# EAGLE design metium_rfm69 (EAGLE 7.6.0)
CNAME: An AA size RF Arduino clone; CREVISION: 1; DESIGNER: Dariusz Mazur
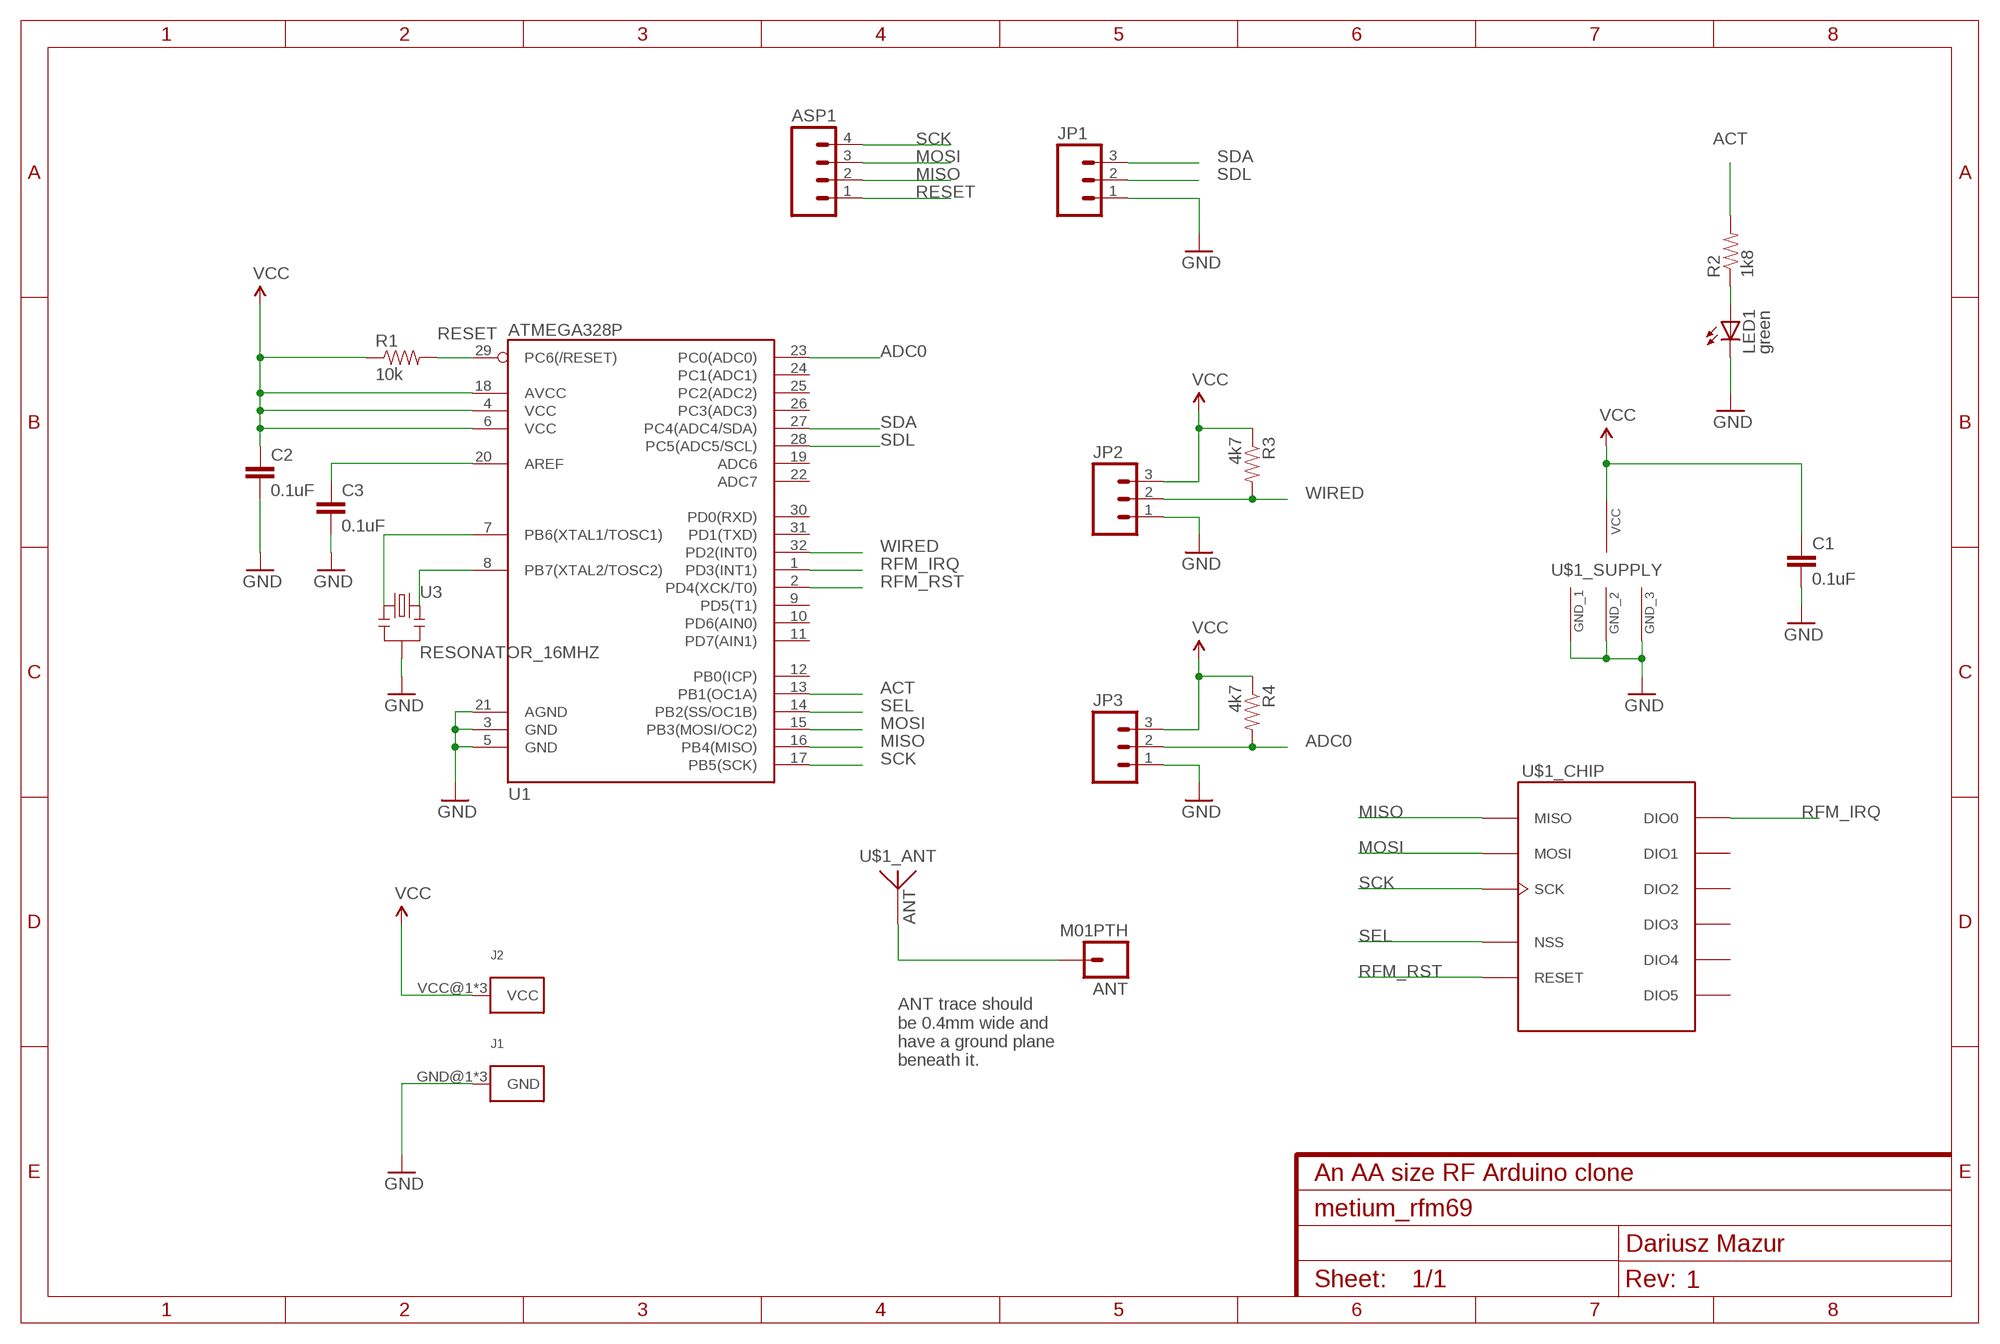
[diagram p0: schematic, sheet 1]

## Parts
ANT  M01PTH  [1X01]
ASP1  M04PTH  [1X04]
C1  0.1uF  0.1UF-25V(+80/-20%)(0603)  [0603-CAP]
C2  0.1uF  0.1UF-25V(+80/-20%)(0603)  [0603-CAP]
C3  0.1uF  0.1UF-25V(+80/-20%)(0603)  [0603-CAP]
J1  KEYSTONE-629  [KEYSTONE_AA_AAA_BATTERY_TERMINAL-629]
J2  KEYSTONE-637  [KEYSTONE_AA_AAA_BATTERY_TERMINAL-637]
JP1  M03PTH  [1X03]
JP2  M03PTH  [1X03]
JP3  M03PTH  [1X03]
LED1  green  LED0603  [LED-0603]
R1  10k  RESISTOR0603-RES  [0603-RES]
R2  1k8  RESISTOR0603-RES  [0603-RES]
R3  4k7  RESISTOR0603-RES  [0603-RES]
R4  4k7  RESISTOR0603-RES  [0603-RES]
U1  ATMEGA328P  ATMEGA328_SMT  [TQFP32-08]
U3  RESONATOR_16MHZ  [RESONATOR_SMD]
U$1  RFM69HCW-S2  [HOPE-RF-16]

## Nets
ACT: R2.2 U1.13(PB1(OC1A))
ADC0: JP3.2 R4.2 U1.23(PC0(ADC0))
GND: C1.2 C2.2 C3.2 J1.GND@1(GND) J1.GND@2(GND) J1.GND@3(GND) JP1.1 JP2.1 JP3.1 LED1.C U1.3(GND) U1.5(GND) U1.21(AGND) U3.2 U$1.GND1(_SUPPLY:GND_1) U$1.GND2(_SUPPLY:GND_2) U$1.GND3(_SUPPLY:GND_3)
MISO: ASP1.2 U1.16(PB4(MISO)) U$1.MISO(_CHIP:MISO)
MOSI: ASP1.3 U1.15(PB3(MOSI/OC2)) U$1.MOSI(_CHIP:MOSI)
N$1: LED1.A R2.1
N$3: ANT.1 U$1.ANT(_ANT:ANT)
N$4: C3.1 U1.20(AREF)
N$5: U1.7(PB6(XTAL1/TOSC1)) U3.1
N$6: U1.8(PB7(XTAL2/TOSC2)) U3.3
RESET: ASP1.1 R1.2 U1.29(PC6(/RESET))
RFM_IRQ: U1.1(PD3(INT1)) U$1.DIO0(_CHIP:DIO0)
RFM_RST: U1.2(PD4(XCK/T0)) U$1.RESET(_CHIP:RESET)
SCK: ASP1.4 U1.17(PB5(SCK)) U$1.SCK(_CHIP:SCK)
SDA: JP1.3 U1.27(PC4(ADC4/SDA))
SDL: JP1.2 U1.28(PC5(ADC5/SCL))
SEL: U1.14(PB2(SS/OC1B)) U$1.NSS(_CHIP:NSS)
VCC: C1.1 C2.1 J2.VCC@1(VCC) J2.VCC@2(VCC) J2.VCC@3(VCC) JP2.3 JP3.3 R1.1 R3.1 R4.1 U1.4(VCC) U1.6(VCC) U1.18(AVCC) U$1.3.3V(_SUPPLY:VCC)
WIRED: JP2.2 R3.2 U1.32(PD2(INT0))
Unconnected: U1.9(PD5(T1)) U1.10(PD6(AIN0)) U1.11(PD7(AIN1)) U1.12(PB0(ICP)) U1.19(ADC6) U1.22(ADC7) U1.24(PC1(ADC1)) U1.25(PC2(ADC2)) U1.26(PC3(ADC3)) U1.30(PD0(RXD)) U1.31(PD1(TXD)) U$1.DIO1(_CHIP:DIO1) U$1.DIO2(_CHIP:DIO2) U$1.DIO3(_CHIP:DIO3) U$1.DIO4(_CHIP:DIO4) U$1.DIO5(_CHIP:DIO5)

## Notes on the sheet
- ANT trace should
  be 0.4mm wide and
  have a ground plane
  beneath it.

## Library data of the parts
ANT = SparkFun-Connectors:M01: Header 1 Standard 1-pin 0.1" header. Use with straight break away headers (SKU : PRT-00116), right angle break away headers (PRT-00553), swiss pins (PRT-00743), machine pins (PRT-00117), and female headers (PRT-00115).
ASP1 = SparkFun-Connectors:M04: Header 4 Standard 4-pin 0.1" header. Use with straight break away headers (SKU : PRT-00116), right angle break away headers (PRT-00553), swiss pins (PRT-00743), machine pins (PRT-00117), and female headers (PRT-00115). Molex polarized connector foot print use with SKU : PRT-08231 with associated crimp pins and housings. 1MM SMD Version SKU: PRT-10208; PROD_ID: CONN-09696
C1-C3 = SparkFun-Capacitors:0.1UF-25V(+80/-20%)(0603): CAP-00810 Ceramic Standard decoupling cap; PROD_ID: CAP-00810
J1 = kanflo:KEYSTONE-629: Keystone 629 PCB Mount Battery Contact for 1 (AA), 1 (AAA), 1 (N), Coil Spring Contact Links Data sheet <http://docs-europe.electrocomponents.com/webdocs/002e/0900766b8002ef6f.pdf> RS Online <http://se.rs-online.com/web/p/battery-holders-mounts/2050057/>
J2 = kanflo:KEYSTONE-637: Keystone 637 PCB Mount Battery Contact for 1 (AA), 1 (AAA), 1 (N), Button Contact Links Data sheet <http://docs-europe.electrocomponents.com/webdocs/13ee/0900766b813ee63e.pdf> RS Online <http://se.rs-online.com/web/p/battery-holders-mounts/3670602/>
JP1-JP3 = SparkFun-Connectors:M03: Header 3 Standard 3-pin 0.1" header. Use with straight break away headers (SKU : PRT-00116), right angle break away headers (PRT-00553), swiss pins (PRT-00743), machine pins (PRT-00117), and female headers (PRT-00115). Molex polarized connector foot print use with SKU : PRT-08232 with associated crimp pins and housings.
LED1 = SparkFun-LED:LED: LEDs Standard schematic elements and footprints for 5mm, 3mm, 1206, and 0603 sized LEDs. 5mm - Spark Fun Electronics SKU : COM-00529 (and others)
R1-R4 = SparkFun-Passives:RESISTOR: Resistor Basic schematic elements and footprints for 0603, 1206, and PTH resistors.
U1 = SparkFun-DigitalIC:ATMEGA328_SMT: 32-Pin Atmega328 part Commonly used on Arduino compatible boards Available in QFP and QFN packages TQFP is IC-09069 QFN is non-stock; PROD_ID: IC-09069
U3 = kanflo:RESONATOR_16MHZ
U$1 = icmi-custom-parts:RFM69HCW: HopeRF RFM69HCW ISM Transceiver Module The RFM69HCW <http://www.hoperf.com/rf/fsk_module/RFM69HCW.htm> is a transceiver module capable of operation over a wide frequency range, including the 315,433,868 and 915MHz license-free ISM (Industry Scientific and Medical) frequency bands. All major RF communication parameters are programmable and most of them can be dynamically set. The RFM69HCW offers the unique advantage of programmable narrow-band and wide- band communication modes. The RFM69HCW is optimized for low power consumption while offering high RF output power and channelized operation. Compliance ETSI and FCC regulations. In order to better use RFM69HCW modules, this specification also involves a large number of the parameters and functions of its core chip RF69H's,including those IC pins which are not leaded out. All of these can help customers gain a better understanding of the performance of RFM69HCW modules, and enhance the application skills.

## Board
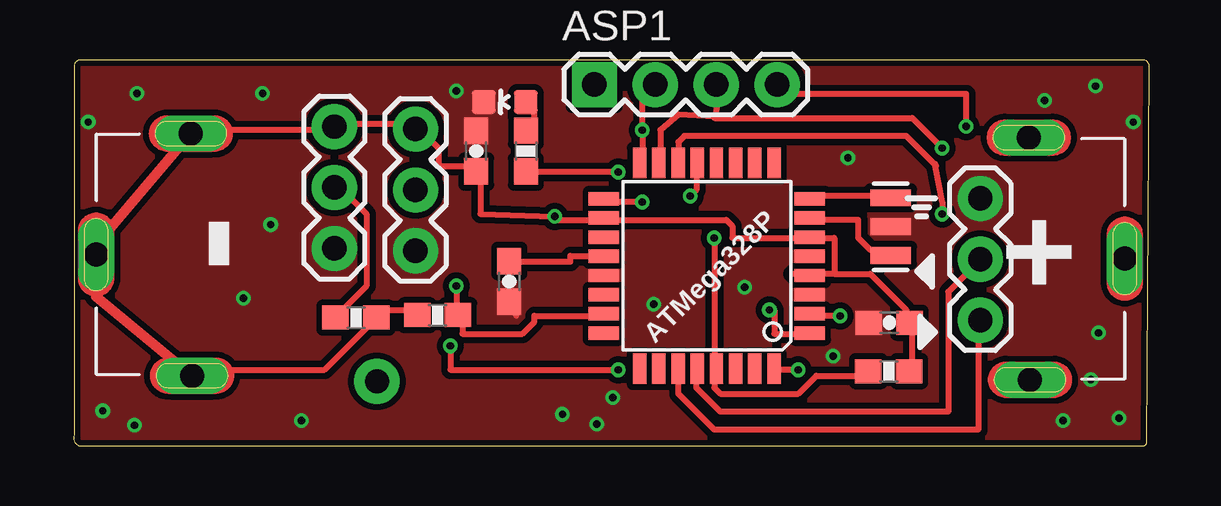
[diagram p1: board, top side]
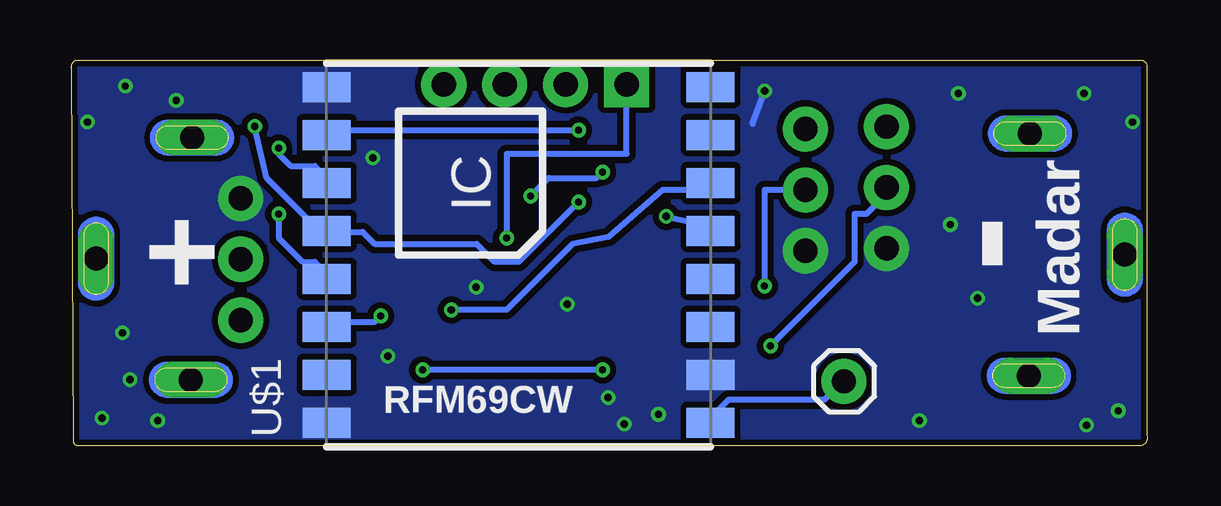
[diagram p2: board, bottom side, seen from below]

Size 44.84 x 16.1 mm. Coordinates in mm from the lower left corner, seen from the top.
Outline: 0.01,15.86 0.01,0.44 arc90 0.25,0.01 44.51,0.01 arc90 44.74,0.14 44.84,15.76 arc90 44.61,16.1 0.35,16.1 arc90 0.01,15.86
Copper layers (1*16): Top 0.035mm / dielectric 1.5mm / Bottom 0.035mm
Design rules "dirt_cheap_dirty_boards.v1 *": minimum track width 10mil, minimum drill 12mil, track to track 10mil, track to pad 10mil, pad to pad 12mil, via to via 12mil, smd to smd 0mil, copper to edge 10mil, drill to drill 12mil, minimum pad ring 10mil, minimum via ring 6mil, stop-mask expansion 2mil, vias tented up to drill 25mil, thermal gap 10mil

### Footprints (pad centres in the part's own frame; a part is rotated, then mirrored left to right if it is on the bottom)
1X01 = drill 1 pad 1.88: 1 0,0
1X04 = drill 1.016 pad 1.88 square: 1 0,0 | drill 1.016 pad 1.88: 2 2.54,0; 3 5.08,0; 4 7.62,0
0603-CAP = smd 1.1 x 1: 1 -0.85,0; 2 0.85,0
KEYSTONE_AA_AAA_BATTERY_TERMINAL-629 = drill 1 pad 1.5 long: GND@1 5,-0.5; GND@2 -0.05,3.45; GND@3 -5.1,-0.55
KEYSTONE_AA_AAA_BATTERY_TERMINAL-637 = drill 1 pad 1.5 long: VCC@1 5,-1.1; VCC@2 -0.05,2.85; VCC@3 -5.1,-1.15
1X03 = drill 1.016 pad 1.88: 1 0,0; 2 2.54,0; 3 5.08,0
LED-0603 = smd 1 x 1: A 0,-0.877; C 0,0.877
0603-RES = smd 1.1 x 1: 1 -0.85,0; 2 0.85,0
TQFP32-08 = smd 1.27 x 0.559: 1 -4.293,2.8; 2 -4.293,2; 3 -4.293,1.2; 4 -4.293,0.4; 5 -4.293,-0.4; 6 -4.293,-1.2; 7 -4.293,-2; 8 -4.293,-2.8; 17 4.293,-2.8; 18 4.293,-2; 19 4.293,-1.2; 20 4.293,-0.4; 21 4.293,0.4; 22 4.293,1.2; 23 4.293,2; 24 4.293,2.8 | smd 0.559 x 1.27: 9 -2.8,-4.293; 10 -2,-4.293; 11 -1.2,-4.293; 12 -0.4,-4.293; 13 0.4,-4.293; 14 1.2,-4.293; 15 2,-4.293; 16 2.8,-4.293; 25 2.8,4.293; 26 2,4.293; 27 1.2,4.293; 28 0.4,4.293; 29 -0.4,4.293; 30 -1.2,4.293; 31 -2,4.293; 32 -2.8,4.293
RESONATOR_SMD = smd 0.7 x 1.7: 1 0.4,0.8; 2 1.6,0.8; 3 2.8,0.8
HOPE-RF-16 = smd 1.25 x 2: 3.3V 1,-8; ANT -7,-8; DIO0 3,-8; DIO1 5,-8; DIO2 7,-8; DIO3 -3,-8; DIO4 -1,-8; DIO5 -5,8; GND1 7,8; GND2 -7,8; GND3 -5,-8; MISO 5,8; MOSI 3,8; NSS -1,8; RESET -3,8; SCK 1,8

### Placement (x,y rotation side)
ANT  12.64,2.7 0 bottom
ASP1  21.7,15.08 0 top
C1  16.78,12.3 90 top
C2  33.99,5.14 180 top
C3  18.15,6.86 270 top
J1  40.36,7.77 270 top
J2  3.79,8.04 90 top
JP1  37.79,10.33 270 top
JP2  10.87,8.24 90 top
JP3  14.25,8.14 90 top
LED1  17.97,14.35 90 top
R1  33.97,3.12 180 top
R2  18.85,12.3 270 top
R3  11.77,5.36 180 top
R4  15.17,5.46 0 top
U1  26.4,7.52 180 top
U3  34.86,7.55 90 top
U$1  26.2,7.98 90 bottom

### Tracks (layer width: path | path; a pad name or v marks a point on that pad's centre or on a via)
ACT  (via drill 0.3)
  Top 0.254: v22.7,11.43 18.95,11.43 R2.2 | v25.7,10.43 25.95,10.68 25.95,11.68 U1.13
  Bottom 0.254: v22.7,11.43 22.95,11.18 24.95,11.18 v25.7,10.43
ADC0  (via drill 0.3)
  Top 0.254: v15.95,6.68 15.95,5.68 R4.2 16.2,5.43 16.2,4.68 18.7,4.68 19.2,5.18 19.2,5.43 21.95,5.43 U1.23
  Bottom 0.254: v15.95,6.68 15.95,10.68 14.45,10.68 JP3.2
GND  (via drill 0.3 pad 0.25)
  Top 0.254: 34.2,9.18 U3.2 | 32.7,5.43 C2.2 | 18.45,5.43 C3.2 | 30.7,7.93 U1.5
  Bottom 0.254: 16.45,13.43 v15.95,14.81
  other vias: 0.61,13.51 2.63,14.71 7.88,14.71 1.21,1.47 2.53,0.87 7.08,6.17 9.5,1.07 20.38,1.32 21.8,0.92 42.72,4.72 8.21,9.24 41.25,1.07 42.4,2.77 43.57,1.17 40.48,14.41 42.6,15.01 44.17,13.51 22.48,2.02 31.66,3.75 32.28,12.02 24.18,5.92 27.98,6.62
  pour Bottom (rank 6, no thermals): 0.01,16.2 44.94,16.2 44.64,0.01 0.01,0.01
  pour Top (rank 6, no thermals): 0.01,16.2 44.94,16.2 44.64,-0.39 0.01,0.01
MISO  (via drill 0.3)
  Top 0.254: U1.16 23.7,12.18 v23.7,13.18 23.7,14.43 24.2,14.93 ASP1.2
  Bottom 0.254: v23.7,13.18 34.2,13.18 U$1.MISO
MOSI  (via drill 0.3)
  Top 0.254: 26.71,13.73 26.75,13.73 26.95,14.93 ASP1.3 | 26.71,13.73 25.2,13.83 24.45,13.18 24.45,12.43 U1.15 | v36.2,12.43 34.95,13.68 26.7,13.68 26.71,13.73
  Bottom 0.254: U$1.MOSI 34.2,11.18 34.7,11.68 35.7,11.68 36.2,12.18 v36.2,12.43
N$1
  Top 0.254: LED1.A 19.2,14.18 19.2,13.18 R2.1
N$3
  Bottom 0.254: U$1.ANT 18.2,1.18 17.45,1.93 13.45,1.93 12.7,2.68 ANT.1
N$4
  Top 0.254: C3.1 18.2,7.68 20.7,7.68 20.7,7.93 21.95,7.93 U1.20
N$5
  Top 0.254: U1.7 30.7,9.43 32.7,9.43 32.7,8.68 33.2,8.18 33.95,8.18 U3.1
N$6
  Top 0.254: U1.8 30.7,10.43 33.95,10.43 U3.3
RESET  (via drill 0.3)
  Top 0.254: v26.7,8.68 26.7,3.68 U1.29 26.7,3.18 26.7,2.43 26.95,2.18 30.2,2.18 30.95,2.93 32.95,2.93 R1.2
  Bottom 0.254: v26.7,8.68 26.7,12.18 21.7,12.18 ASP1.1 21.7,15.18
RFM_IRQ  (via drill 0.3)
  Top 0.254: U1.1 30.45,4.68 29.2,4.68 29.2,5.68 v29,5.68
  Bottom 0.254: U$1.DIO0 18.2,10.68 20.2,10.68 22.45,8.73 23.95,8.43 26.7,5.68 v29,5.68 29.2,5.68
RFM_RST  (via drill 0.3)
  Top 0.254: v31.95,5.43 30.7,5.43 U1.2
  Bottom 0.254: v31.95,5.43 32.2,5.18 34.2,5.18 U$1.RESET
SCK  (via drill 0.3)
  Top 0.254: 29.45,14.93 ASP1.4 29.7,14.68 37.2,14.68 v37.2,13.33 37.2,13.18 | v23.7,10.18 22.2,10.18 U1.17
  Bottom 0.254: 34.2,8.68 34.2,8.93 | v37.2,13.33 36.7,11.18 34.7,9.18 34.2,9.18 U$1.SCK 34.2,8.93 | v23.7,10.18 26.2,7.68 27.2,7.68 27.95,8.43 32.2,8.43 32.7,8.93 34.2,8.93
SDA
  Top 0.254: U1.27 25.2,3.18 25.2,2.18 26.7,0.68 37.7,0.68 37.7,5.18 JP1.3
SDL
  Top 0.254: U1.28 25.95,3.18 25.95,2.43 26.95,1.43 36.45,1.43 36.45,6.43 37.7,7.68 JP1.2
SEL  (via drill 0.3)
  Top 0.254: U1.14 25.2,12.68 25.45,12.93 34.7,12.93 35.95,11.68 35.92,11.67 | 35.92,11.67 36.2,10.18 v36.2,9.68 | 35.92,11.67 35.9,11.78
  Bottom 0.254: v36.2,9.68 36.2,8.68 35.2,7.68 34.7,7.68 34.2,7.18 U$1.NSS
VCC  (via drill 0.3)
  Top 0.254: J2.VCC@3 4.95,3.18 10.45,3.18 12.45,5.18 R3.1 12.7,5.68 14.2,5.68 R4.1 | JP3.3 14.2,13.43 10.95,13.43 JP2.3 10.7,13.18 5.2,13.18 J2.VCC@1 | 34.45,3.43 R1.1 34.95,3.43 34.95,5.18 C2.1 | 34.45,5.18 C2.1 | 14.45,13.43 JP3.3 | 34.7,5.43 C2.1 | 29.95,7.18 30.45,7.18 U1.4 30.7,7.18 31.7,7.18 | 31.7,7.18 31.7,8.68 30.7,8.68 U1.6 30.45,8.68 27.45,8.68 27.45,9.18 27.2,9.43 22.2,9.43 U1.18 21.95,9.43 19.95,9.43 v20.05,9.58 16.95,9.68 16.95,11.43 C1.1 16.7,11.68 15.2,11.68 15.2,12.43 14.45,13.18 JP3.3 | 31.7,7.18 33.2,7.18 34.7,5.68 C2.1
  Top 0.406: J2.VCC@1 0.94,8.39 J2.VCC@2 0.94,6.24 J2.VCC@3
  Bottom 0.254: 18.2,8.93 U$1.3.3V 18.2,9.18 v20.05,9.58
WIRED  (via drill 0.3)
  Top 0.254: 10.7,5.18 R3.2 11.2,5.68 12.2,6.68 12.2,9.68 11.2,10.68 JP2.2 | v30.2,3.18 29.2,3.18 U1.32 | v22.7,3.18 15.7,3.18 v15.7,4.18
  Bottom 0.254: v22.7,3.18 v30.2,3.18 | v15.7,4.18 12.2,7.68 12.2,9.68 11.7,9.68 10.7,10.68 JP2.2

### Text on the board
tNames: - | + | ATMega328P
bNames: Madar | - | + | RFM69CW